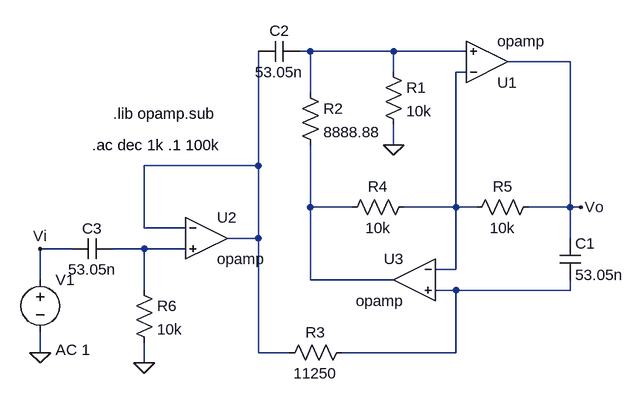
[diagram p0: schematic ejercicio 18-5-2020.asc]
ejercicio 18-5-2020.asc, the LTspice schematic file:
Version 4
SHEET 1 2280 680
WIRE -464 -224 -480 -224
WIRE -336 -224 -464 -224
WIRE -224 -224 -336 -224
WIRE -64 -208 -160 -208
WIRE -336 -192 -336 -224
WIRE -224 -192 -240 -192
WIRE -464 -160 -464 -224
WIRE -336 -80 -336 -112
WIRE -544 -48 -544 -224
WIRE -544 -48 -720 -48
WIRE -464 16 -464 -80
WIRE -400 16 -464 16
WIRE -240 16 -240 -192
WIRE -240 16 -320 16
WIRE -208 16 -240 16
WIRE -64 16 -64 -208
WIRE -64 16 -128 16
WIRE -48 16 -64 16
WIRE -720 48 -720 -48
WIRE -656 48 -720 48
WIRE -544 64 -544 -48
WIRE -544 64 -592 64
WIRE -64 64 -64 16
WIRE -832 80 -880 80
WIRE -720 80 -768 80
WIRE -656 80 -720 80
WIRE -240 112 -240 16
WIRE -240 112 -272 112
WIRE -880 128 -880 80
WIRE -464 128 -464 16
WIRE -336 128 -464 128
WIRE -720 144 -720 80
WIRE -240 144 -272 144
WIRE -64 144 -64 128
WIRE -64 144 -240 144
WIRE -880 240 -880 208
WIRE -544 240 -544 64
WIRE -496 240 -544 240
WIRE -240 240 -240 144
WIRE -240 240 -416 240
WIRE -720 256 -720 224
FLAG -880 240 0
FLAG -880 80 Vi
FLAG -336 -80 0
FLAG -720 256 0
FLAG -48 16 Vo
SYMBOL Opamps\\opamp -192 -144 M180
SYMATTR InstName U1
SYMATTR SpiceLine Aol=10000K
SYMATTR SpiceLine2 GBW=100000Meg
SYMBOL voltage -880 112 R0
WINDOW 123 24 124 Left 2
WINDOW 39 0 0 Left 0
SYMATTR Value2 AC 1
SYMATTR InstName V1
SYMATTR Value ""
SYMBOL Opamps\\opamp -624 0 R0
SYMATTR InstName U2
SYMATTR SpiceLine Aol=10000K
SYMATTR SpiceLine2 GBW=100000Meg
SYMBOL Opamps\\opamp -304 64 M0
SYMATTR InstName U3
SYMATTR SpiceLine Aol=10000K
SYMATTR SpiceLine2 GBW=100000Meg
SYMBOL res -352 -208 R0
SYMATTR InstName R1
SYMATTR Value 10k
SYMBOL res -480 -176 R0
SYMATTR InstName R2
SYMATTR Value 8888.88
SYMBOL res -400 224 R90
WINDOW 0 0 56 VBottom 2
WINDOW 3 32 56 VTop 2
SYMATTR InstName R3
SYMATTR Value 11250
SYMBOL res -304 0 R90
WINDOW 0 0 56 VBottom 2
WINDOW 3 32 56 VTop 2
SYMATTR InstName R4
SYMATTR Value 10k
SYMBOL res -112 0 R90
WINDOW 0 0 56 VBottom 2
WINDOW 3 32 56 VTop 2
SYMATTR InstName R5
SYMATTR Value 10k
SYMBOL cap -80 64 R0
SYMATTR InstName C1
SYMATTR Value 53.05n
SYMBOL cap -480 -240 R90
WINDOW 0 0 32 VBottom 2
WINDOW 3 32 32 VTop 2
SYMATTR InstName C2
SYMATTR Value 53.05n
SYMBOL res -736 128 R0
SYMATTR InstName R6
SYMATTR Value 10k
SYMBOL cap -768 64 R90
WINDOW 0 0 32 VBottom 2
WINDOW 3 32 32 VTop 2
SYMATTR InstName C3
SYMATTR Value 53.05n
TEXT -768 -128 Left 2 !.lib opamp.sub
TEXT -800 -80 Left 2 !.ac dec 1k .1 100k

The netlist it stands for:
* ejercicio 18-5-2020.asc
XU1 N002 N001 Vo opamp Aol=10000K GBW=100000Meg  ; pins invin noninvin out
V1 Vi 0 AC 1
XU2 N003 N005 N003 opamp Aol=10000K GBW=100000Meg  ; pins invin noninvin out
XU3 N002 N006 N004 opamp Aol=10000K GBW=100000Meg  ; pins invin noninvin out
R1 N001 0 10k
R2 N001 N004 8888.88
R3 N006 N003 11250
R4 N002 N004 10k
R5 Vo N002 10k
C1 Vo N006 53.05n
C2 N001 N003 53.05n
R6 N005 0 10k
C3 N005 Vi 53.05n
.lib opamp.sub
.ac dec 1k .1 100k
.backanno
.end